# Altium schematic sheet ut_bbr18_mb_ethernet.SchDoc
size A4
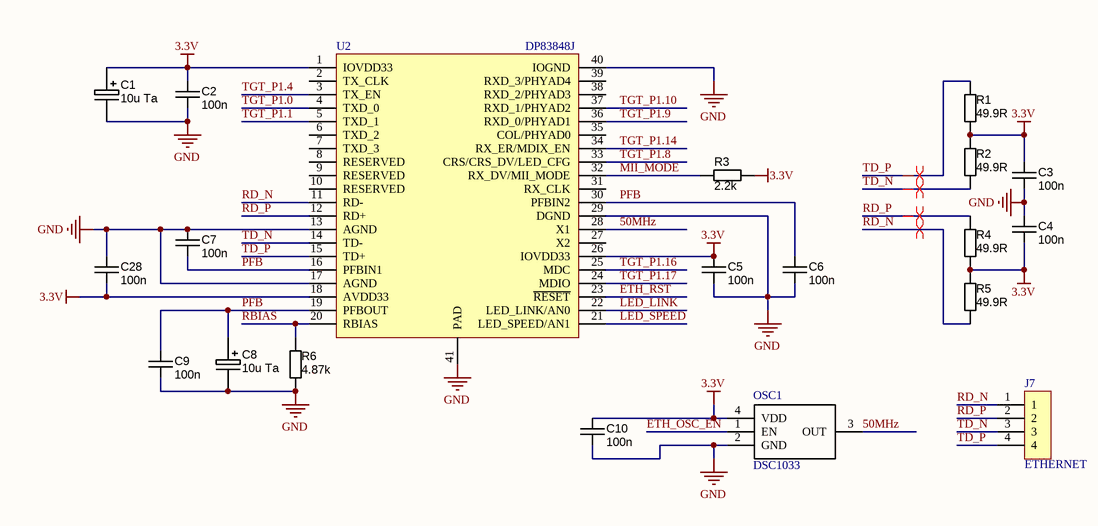
[diagram p0: ut_bbr18_mb_ethernet.SchDoc]

## Parts
C1  10u Ta  [CAPMP3528X210N]
C2  100n  [CAPC1608X90N]
C3  100n  [CAPC1608X90N]
C4  100n  [CAPC1608X90N]
C5  100n  [CAPC1608X90N]
C6  100n  [CAPC1608X90N]
C7  100n  [CAPC1608X90N]
C8  10u Ta  [CAPMP3528X210N]
C9  100n  [CAPC1608X90N]
C10  100n  [CAPC1608X90N]
C28  100n  [CAPC1608X90N]
J7  ETHERNET  [MICRO-MATCH-FOB-04]
OSC1  DSC1033  [DSC1033-3.2x2.5]
R1  49.9R  [RESC1608X55N]
R2  49.9R  [RESC1608X55N]
R3  2.2k  [RESC1608X55N]
R4  49.9R  [RESC1608X55N]
R5  49.9R  [RESC1608X55N]
R6  4.87k  [RESC1608X55N]
U2  DP83848J  [WQFN40]

## Nets
3.3V: C1.1 C2.2 C3.2 C4.1 C5.2 C10.2 C28.2 OSC1.4(VDD) R1.2 R2.1 R3.1 R4.2 R5.1 U2.1(IOVDD33) U2.18(AVDD33) U2.26(IOVDD33)
GND: C1.2 C2.1 C3.1 C4.2 C5.1 C6.1 C7.1 C8.2 C9.1 C10.1 C28.1 OSC1.2(GND) R6.2 U2.13(AGND) U2.17(AGND) U2.29(DGND) U2.40(IOGND) U2.41(PAD)
50MHz: OSC1.3(OUT) U2.28(X1)
ETH_OSC_EN: OSC1.1(EN)
ETH_RST: U2.23(~{RESET})
LED_LINK: U2.22(LED_LINK/AN0)
LED_SPEED: U2.21(LED_SPEED/AN1)
MII_MODE: R3.2 U2.32(RX_DV/MII_MODE)
PFB: C6.2 C7.2 C8.1 C9.2 U2.16(PFBIN1) U2.19(PFBOUT) U2.30(PFBIN2)
RBIAS: R6.1 U2.20(RBIAS)
RD_N: J7.1 R5.2 U2.11(RD-)
RD_P: J7.2 R4.1 U2.12(RD+)
TD_N: J7.3 R2.2 U2.14(TD-)
TD_P: J7.4 R1.1 U2.15(TD+)
TGT_P1.0: U2.4(TXD_0)
TGT_P1.1: U2.5(TXD_1)
TGT_P1.4: U2.3(TX_EN)
TGT_P1.8: U2.33(CRS/CRS_DV/LED_CFG)
TGT_P1.9: U2.36(RXD_0/PHYAD1)
TGT_P1.10: U2.37(RXD_1/PHYAD2)
TGT_P1.14: U2.34(RX_ER/MDIX_EN)
TGT_P1.16: U2.25(MDC)
TGT_P1.17: U2.24(MDIO)

Not connected (* = marked no-connect by the designer): U2 2(TX_CLK) 6(TXD_2) 7(TXD_3) 8(RESERVED) 9(RESERVED) 10(RESERVED) 27(X2) 31(RX_CLK) 35(COL/PHYAD0) 38(RXD_2/PHYAD3) 39(RXD_3/PHYAD4)

## Layout directives
differential pair: RD_N, RD_P, TD_N, TD_P

## Library data of the parts
C1 C8 = CAPT_47u_1210_6V3: Capacitor SMD Tantalum 47uF 20% 6.3V 1210; Manufacturer 1: AVX Corporation; Manufacturer Part Number 1: TCJB476M006R0070; Manufacturer Size Code: B; Voltage - Rated: 6V3; ESR (Equivalent Series Resistance): 70.0 mOhm; Type: Molded; Value: 47µ; SCDType: spec; Package / Case: 1210 (3528 Metric); Tolerance: ±20%; Material: Tantalum; Supplier 1: Digi-Key; Supplier Part Number 1: 478-3139-1-ND; Operating Temperature: -55°C ~ 125°C; Size / Dimension: 0.138" L x 0.110" W (3.50mm x 2.80mm); Height - Seated (Max): 0.083" (2.10mm); ComponentLink1URL: http://www.avx.com/docs/Catalogs/tcj.pdf; ComponentLink1Description: http://www.avx.com/docs/Catalogs/tcj.pdf; Ratings: 6.3V
C2-C7 C9 C10 C28 = CAPC_18p_0603_100V: Capacitor SMD Cer 18pF 2% 100V NP0 0603; Manufacturer 1: AVX Corporation; Manufacturer Part Number 1: 06031A180GAT2A; Ratings: 100V; NP0; Value: 18p; SCDType: spec; Tolerance: ±2%; Operating Temperature: -55°C ~ 125°C; Package / Case: 0603 (1608 Metric); Supplier 1: Digi-Key; Supplier Part Number 1: 478-6025-1-ND; Size / Dimension: 0.063" L x 0.032" W (1.60mm x 0.81mm); Thickness (Max): 0.035" (0.90mm); ComponentLink1URL: http://www.avx.com/docs/Catalogs/ccog.pdf; ComponentLink1Description: http://www.avx.com/docs/Catalogs/ccog.pdf
J7 = HEADER-4
R1-R6 = RES_10K_0603_5%: Resistor SMD chip 10k Ohm 0.1W 5% 0603; Manufacturer 1: Yageo; Manufacturer Part Number 1: RC0603JR-0710KL; Ratings: 1/10 W; SCDType: spec; Package / Case: 0603 (1608 metric); Tolerance: ±5%; Material: Thick Film; Supplier 1: Digi-Key; Supplier Part Number 1: 311-10KGRCT-ND; Supplier 2: Digi-Key; Supplier Part Number 2: 541-10KGCT-ND; Manufacturer 2: Vishay Dale; Manufacturer Part Number 2: CRCW060310K0JNEA; ComponentLink2URL: http://www.vishay.com/doc?20035; ComponentLink2Description: http://www.vishay.com/doc?20035; ComponentLink1URL: http://www.yageo.com/documents/recent/PYu-RC0603_51_RoHS_L_4.pdf; ComponentLink1Description: http://www.yageo.com/documents/recent/PYu-RC0603_51_RoHS_L_4.pdf; Value: 10K